# EAGLE design microphone (EAGLE 7.7.0)
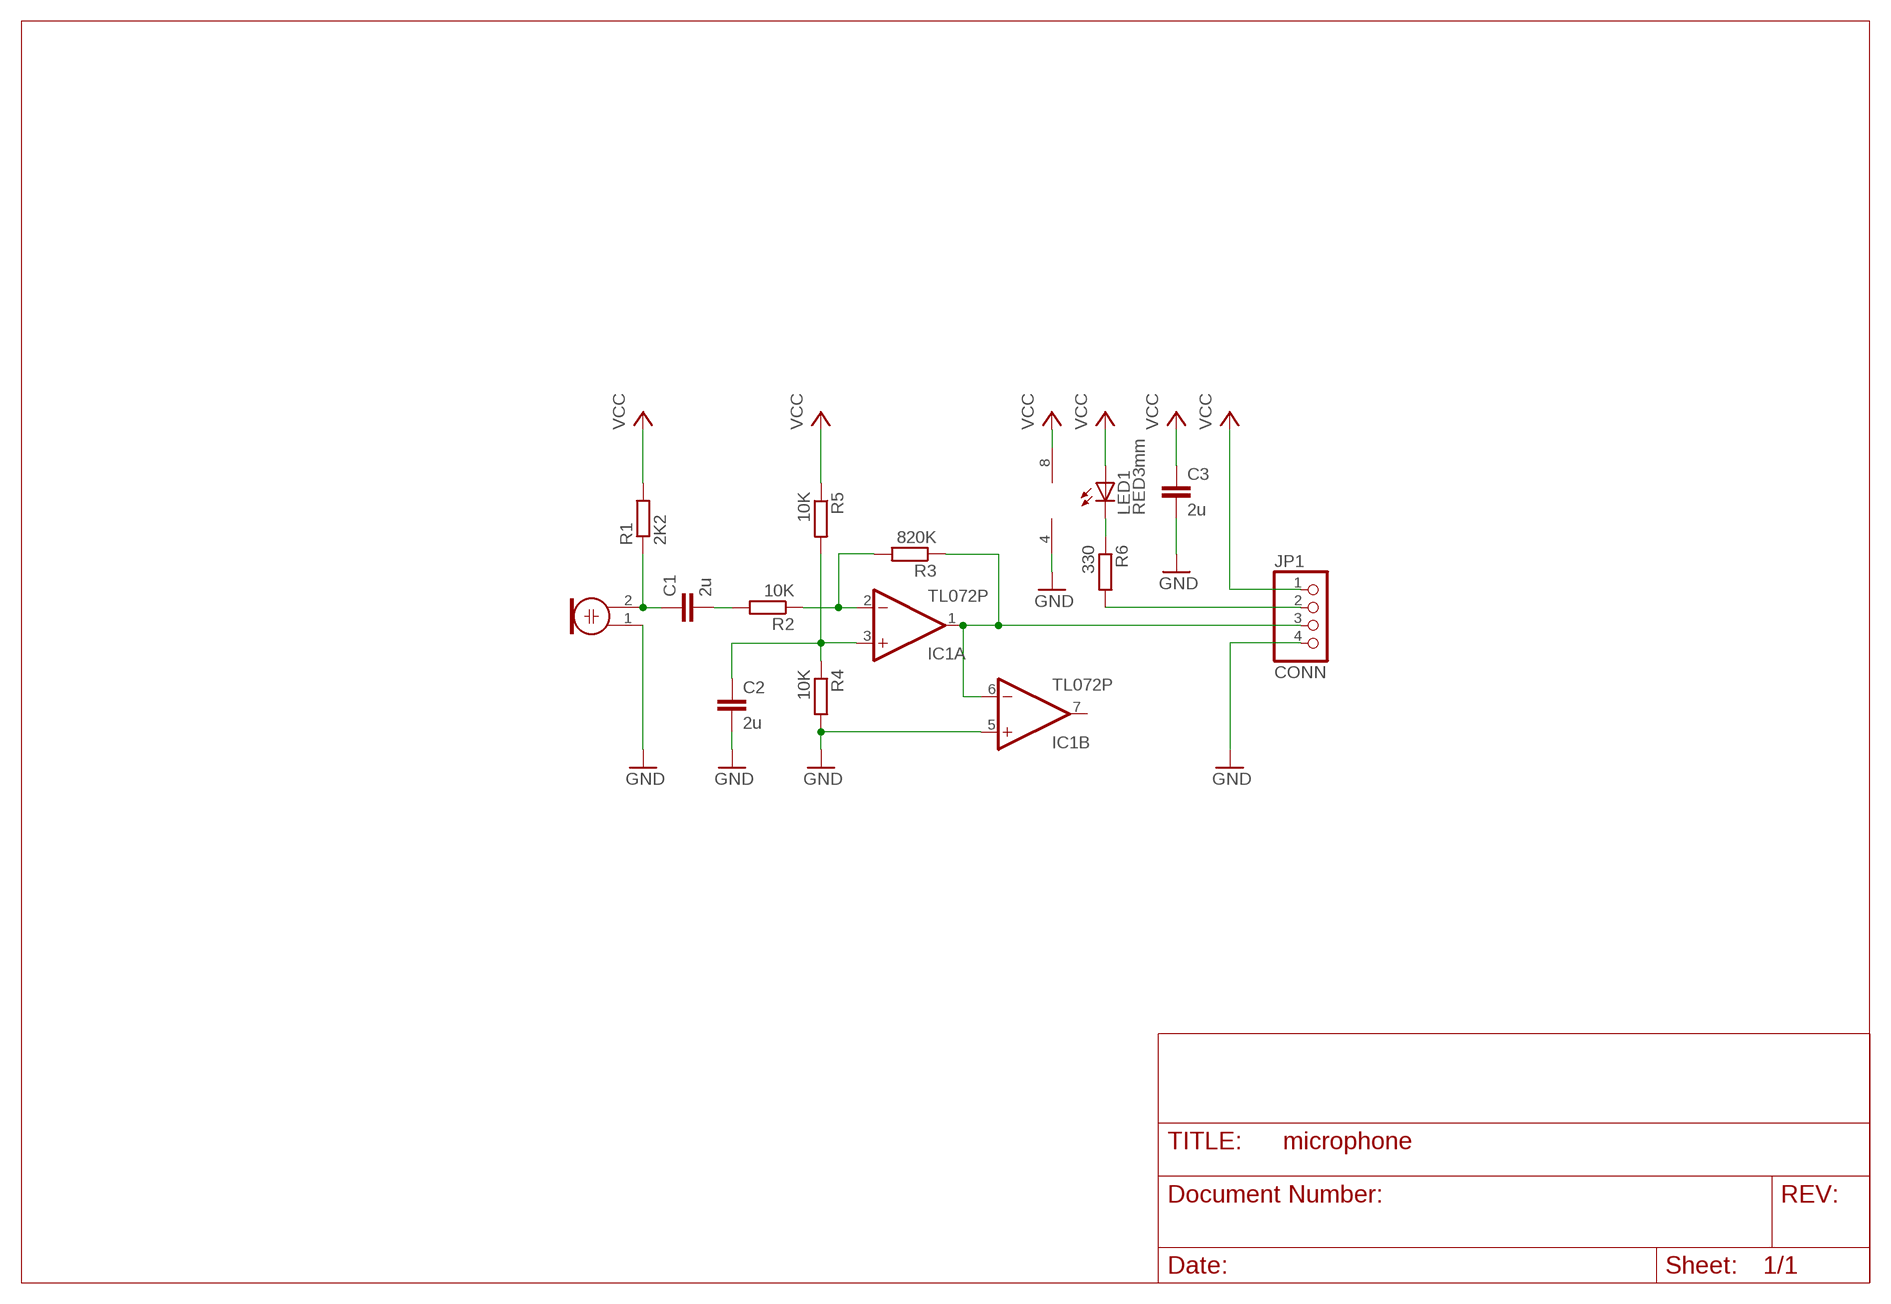
[diagram p0: schematic, sheet 1]

## Parts
C1  2u  C-EU050-025X075  [C050-025X075]
C2  2u  C-EU025-025X050  [C025-025X050]
C3  2u  C-EU075-032X103  [C075-032X103]
IC1  TL072P  [DIL08]
JP1  CONN  PINHD-1X4  [1X04]
LED1  RED3mm  LED5MM  [LED5MM]
M1  ELECTRET_MICROPHON-F6035AP  [F6035AP]
R1  2K2  R-EU_0204/7  [0204/7]
R2  10K  R-EU_0204/2V  [0204V]
R3  820K  R-EU_0204/2V  [0204V]
R4  10K  R-EU_0204/2V  [0204V]
R5  10K  R-EU_0204/7  [0204/7]
R6  330  R-EU_0204/7  [0204/7]

## Nets
AMP_OUT: IC1.1(A:OUT) IC1.6(B:-IN) JP1.3 R3.1
GND: C2.2 C3.2 IC1.4(P:V-) IC1.5(B:+IN) JP1.4 M1.1 R4.2
LED_IN: JP1.2 R6.2
LED_IN_: LED1.K(C) R6.1
MIC_IN_BIAS: C1.2 R2.2
MIC_OUT: C1.1 M1.2 R1.1
OP+: C2.1 IC1.3(A:+IN) R4.1 R5.2
OP-: IC1.2(A:-IN) R2.1 R3.2
VCC: C3.1 IC1.8(P:V+) JP1.1 LED1.A R1.2 R5.1
Unconnected: IC1.7(B:OUT)

## Library data of the parts
C1-C3 = rcl:C-EU: CAPACITOR, European symbol
IC1 = linear:TL072: OP AMP
JP1 = pinhead:PINHD-1X4: PIN HEADER
LED1 = led:LED: LED OSRAM: - CHIPLED LG R971, LG N971, LY N971, LG Q971, LY Q971, LO R971, LY R971 LH N974, LH R974 LS Q976, LO Q976, LY Q976 LO Q996 - Hyper CHIPLED LW Q18S LB Q993, LB Q99A, LB R99A - SideLED LS A670, LO A670, LY A670, LG A670, LP A670 LB A673, LV A673, LT A673, LW A673 LH A674 LY A675 LS A676, LA A676, LO A676, LY A676, LW A676 LS A679, LY A679, LG A679 - Hyper Micro SIDELED® LS Y876, LA Y876, LO Y876, LY Y876 LT Y87S - SmartLED LW L88C, LW L88S LB L89C, LB L89S, LG L890 LS L89K, LO L89K, LY L89K LS L896, LA L896, LO L896, LY L896 - TOPLED LS T670, LO T670, LY T670, LG T670, LP T670 LSG T670, LSP T670, LSY T670, LOP T670, LYG T670 LG T671, LOG T671, LSG T671 LB T673, LV T673, LT T673, LW T673 LH T674 LS T676, LA T676, LO T676, LY T676, LB T676, LH T676, LSB T676, LW T676 LB T67C, LV T67C, LT T67C, LS T67K, LO T67K, LY T67K, LW E67C LS E67B, LA E67B, LO E67B, LY E67B, LB E67C, LV E67C, LT E67C LW T67C LS T679, LY T679, LG T679 LS T770, LO T770, LY T770, LG T770, LP T770 LB T773, LV T773, LT T773, LW T773 LH T774 LS E675, LA E675, LY E675, LS T675 LS T776, LA T776, LO T776, LY T776, LB T776 LHGB T686 LT T68C, LB T68C - Hyper Mini TOPLED® LB M676 - Mini TOPLED Santana® LG M470 LS M47K, LO M47K, LY M47K Source: http://www.osram.convergy.de LUXEON: - LUMILED® LXK2-PW12-R00, LXK2-PW12-S00, LXK2-PW14-U00, LXK2-PW14-V00 LXK2-PM12-R00, LXK2-PM12-S00, LXK2-PM14-U00 LXK2-PE12-Q00, LXK2-PE12-R00, LXK2-PE12-S00, LXK2-PE14-T00, LXK2-PE14-U00 LXK2-PB12-K00, LXK2-PB12-L00, LXK2-PB12-M00, LXK2-PB14-N00, LXK2-PB14-P00, LXK2-PB14-Q00 LXK2-PR12-L00, LXK2-PR12-M00, LXK2-PR14-Q00, LXK2-PR14-R00 LXK2-PD12-Q00, LXK2-PD12-R00, LXK2-PD12-S00 LXK2-PH12-R00, LXK2-PH12-S00 LXK2-PL12-P00, LXK2-PL12-Q00, LXK2-PL12-R00 Source: www.luxeon.com KINGBRIGHT: KA-3528ASYC Source: www.kingbright.com
M1 = microphon:ELECTRET_MICROPHON-: Electret Condenser Microphone
R1-R6 = rcl:R-EU_: RESISTOR, European symbol

## Board
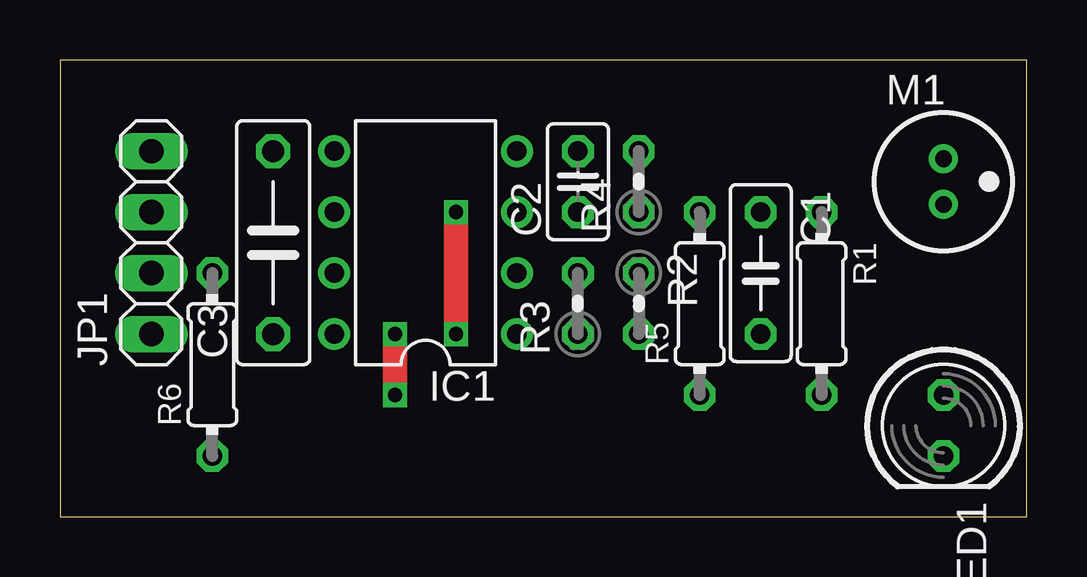
[diagram p1: board, top side]
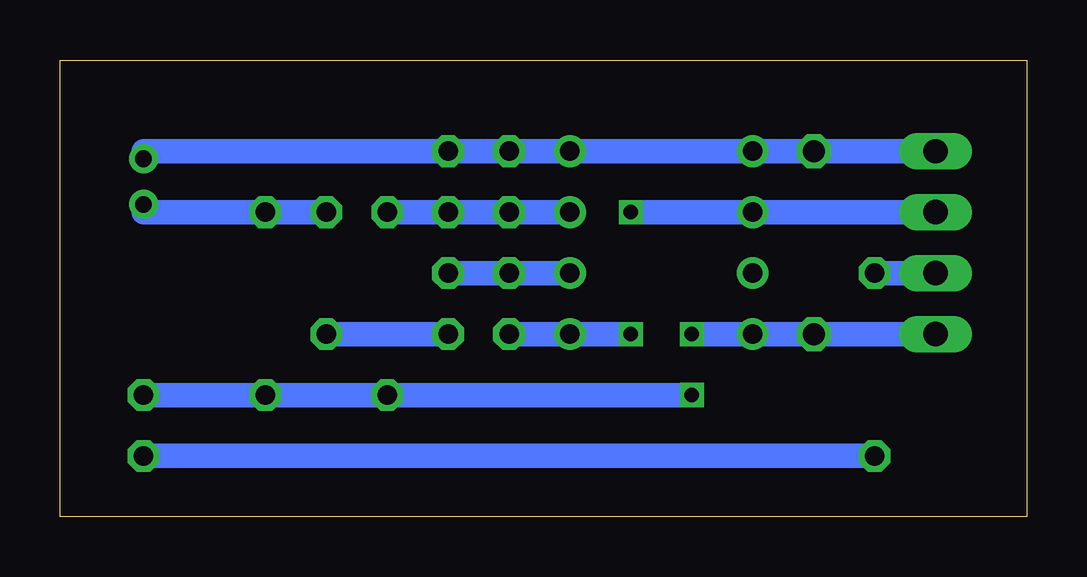
[diagram p2: board, bottom side, seen from below]

Size 40.31 x 19.04 mm. Coordinates in mm from the lower left corner, seen from the top.
Outline: 0,0 40.31,0 40.31,19.04 0,19.04 0,0
Copper layers (1*16): Top 0.035mm / dielectric 1.5mm / Bottom 0.035mm
Design rules "default *": minimum track width 40mil, minimum drill 20mil, track to track 8mil, track to pad 8mil, pad to pad 8mil, via to via 8mil, smd to smd 8mil, copper to edge 40mil, drill to drill 8mil, minimum pad ring 10mil, minimum via ring 8mil, stop-mask expansion 4mil, vias tented up to drill 0mil, thermal gap 10mil

### Footprints (pad centres in the part's own frame; a part is rotated, then mirrored left to right if it is on the bottom)
C050-025X075 = drill 0.813 octagon: 1 -2.54,0; 2 2.54,0
C025-025X050 = drill 0.813 octagon: 1 -1.27,0; 2 1.27,0
C075-032X103 = drill 0.914 octagon: 1 -3.81,0; 2 3.81,0
DIL08 = drill 0.813 pad 1.27: 1 -3.81,-3.81; 2 -1.27,-3.81; 3 1.27,-3.81; 4 3.81,-3.81; 5 3.81,3.81; 6 1.27,3.81; 7 -1.27,3.81; 8 -3.81,3.81
1X04 = drill 1.016 long: 1 -3.81,0; 2 -1.27,0; 3 1.27,0; 4 3.81,0
LED5MM = drill 0.813 octagon: A -1.27,0; K 1.27,0
F6035AP = drill 0.7 pad 1.2: 1 0,0.95; 2 0,-0.95
0204/7 = drill 0.813 octagon: 1 -3.81,0; 2 3.81,0
0204V = drill 0.813 octagon: 1 -1.27,0; 2 1.27,0

### Placement (x,y rotation side)
C1  29.21,10.16 270 top
C2  21.59,13.97 90 top
C3  8.89,11.43 90 top
IC1  15.24,11.43 90 top
JP1  3.81,11.43 90 top
LED1  36.83,3.81 270 top
M1  36.83,13.97 0 top
R1  31.75,8.89 270 top
R2  24.13,8.89 270 top
R3  21.59,8.89 90 top
R4  24.13,13.97 90 top
R5  26.67,8.89 90 top
R6  6.35,6.35 90 top

### Tracks (layer width: path | path; a pad name or v marks a point on that pad's centre or on a via)
AMP_OUT  (via drill 0.6)
  Top 1.016: v16.51,7.62 v16.51,12.7
  Bottom 1.016: R3.1 IC1.1 v16.51,7.62 | v16.51,12.7 IC1.6 JP1.3
GND
  Bottom 1.016: JP1.4 C3.2 IC1.5 IC1.4 C2.2 R4.2 36.83,15.24 M1.1
LED_IN
  Bottom 1.016: JP1.2 R6.2
LED_IN_
  Bottom 1.016: R6.1 LED1.K
MIC_IN_BIAS
  Bottom 1.016: C1.2 R2.2
MIC_OUT
  Bottom 1.016: C1.1 R1.1 36.83,12.7 M1.2
OP+
  Bottom 1.016: IC1.3 C2.1 R4.1 R5.2
OP-
  Bottom 1.016: R2.1 R3.2 IC1.2
VCC  (via drill 0.6)
  Top 1.016: v13.97,7.62 v13.97,5.08
  Bottom 1.016: JP1.1 C3.1 IC1.8 v13.97,7.62 | v13.97,5.08 R5.1 R1.2 LED1.A